# EAGLE design rfidbadge (EAGLE 6.6.0)
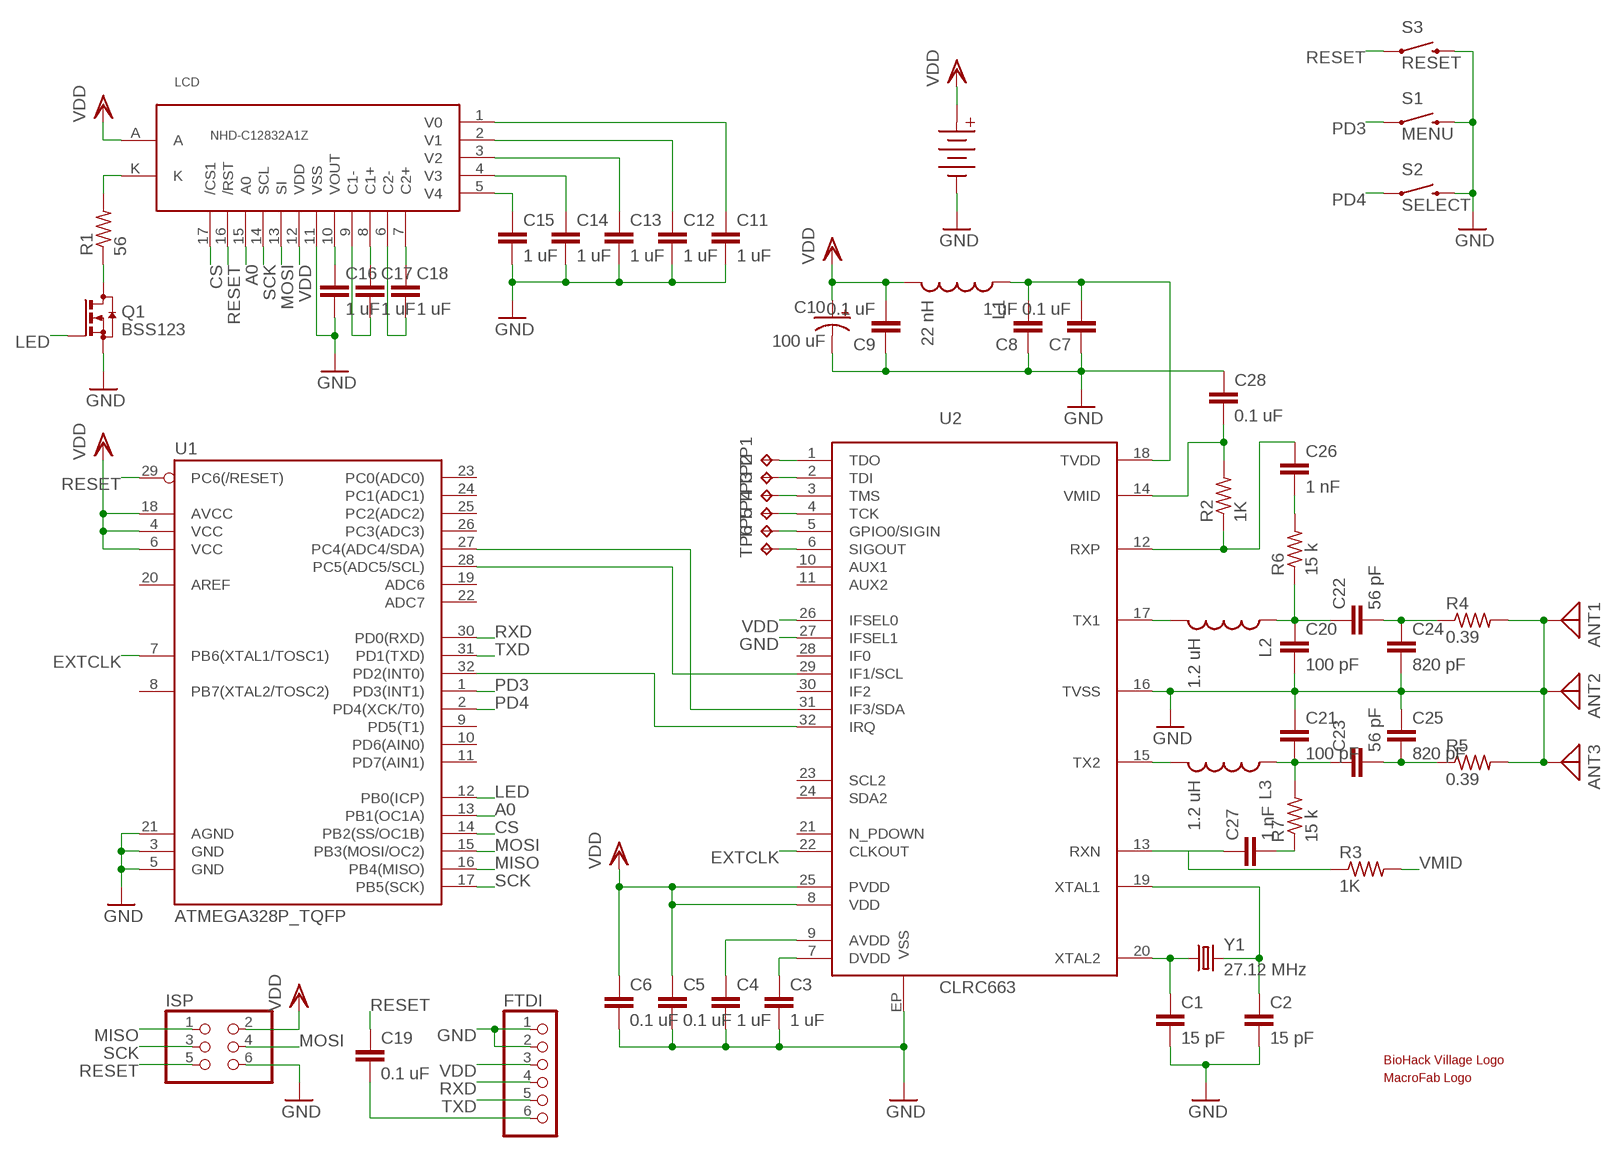
[diagram p0: schematic, sheet 1]

## Parts
ANT1  ANTENNA  [PAD-01]
ANT2  ANTENNA  [PAD-01]
ANT3  ANTENNA  [PAD-01]
BAT  AAA_X3  [AAA_X3]
C1  15 pF  C-EUC0603K  [C0603K]
C2  15 pF  C-EUC0603K  [C0603K]
C3  1 uF  C-EUC0603K  [C0603K]
C4  1 uF  C-EUC0603K  [C0603K]
C5  0.1 uF  C-EUC0603K  [C0603K]
C6  0.1 uF  C-EUC0603K  [C0603K]
C7  0.1 uF  C-EUC0603K  [C0603K]
C8  1 uF  C-EUC0603K  [C0603K]
C9  0.1 uF  C-EUC0603K  [C0603K]
C10  100 uF  CAP_POL7343  [EIA7343]
C11  1 uF  C-EUC0603K  [C0603K]
C12  1 uF  C-EUC0603K  [C0603K]
C13  1 uF  C-EUC0603K  [C0603K]
C14  1 uF  C-EUC0603K  [C0603K]
C15  1 uF  C-EUC0603K  [C0603K]
C16  1 uF  C-EUC0603K  [C0603K]
C17  1 uF  C-EUC0603K  [C0603K]
C18  1 uF  C-EUC0603K  [C0603K]
C19  0.1 uF  C-EUC0603K  [C0603K]
C20  100 pF  C-EUC0603K  [C0603K]
C21  100 pF  C-EUC0603K  [C0603K]
C22  56 pF  C-EUC0603K  [C0603K]
C23  56 pF  C-EUC0603K  [C0603K]
C24  820 pF  C-EUC0603K  [C0603K]
C25  820 pF  C-EUC0603K  [C0603K]
C26  1 nF  C-EUC0603K  [C0603K]
C27  1 nF  C-EUC0603K  [C0603K]
C28  0.1 uF  C-EUC0603K  [C0603K]
FTDI  PINHD-1X6  [1X06]
ISP  PINHD-2X3  [2X03]
L1  22 nH  INDUCTOR30OHM,1.8A  [0603]
L2  1.2 uH  INDUCTOR30OHM,1.8A  [0603]
L3  1.2 uH  INDUCTOR30OHM,1.8A  [0603]
LCD  NHD-C12832A1Z  [NHD-C12832A1Z]
Q1  BSS123  [SOT23]
R1  56  R-US_R0603  [R0603]
R2  1K  R-US_R0603  [R0603]
R3  1K  R-US_R0603  [R0603]
R4  0.39  R-US_R0603  [R0603]
R5  0.39  R-US_R0603  [R0603]
R6  15 k  R-US_R0603  [R0603]
R7  15 k  R-US_R0603  [R0603]
S1  MENU  SWITCH-MOMENTARY-2SMD-4  [TACTILE_SWITCH_TALL]
S2  SELECT  SWITCH-MOMENTARY-2SMD-4  [TACTILE_SWITCH_TALL]
S3  RESET  SWITCH-MOMENTARY-2SMD-1101NE  [TACTILE-SWITCH-1101NE]
TP1  TPTP06R  [TP06R]
TP2  TPTP06R  [TP06R]
TP3  TPTP06R  [TP06R]
TP4  TPTP06R  [TP06R]
TP5  TPTP06R  [TP06R]
TP6  TPTP06R  [TP06R]
U1  ATMEGA328P_TQFP  [TQFP32-08]
U2  CLRC663  [QFN32]
U$1  BHVLOGO  [BHVLOGO]
U$2  MACROFABLOGO  [MACROFABLOGO]
Y1  27.12 MHz  CRYSTALCRYSTAL-SMD-5X3-12.288MHZ  [CRYSTAL-SMD-5X3]

## Nets
A0: LCD.15(A0) U1.13(PB1(OC1A))
C1+: C17.1 LCD.8(C1+)
C1-: C17.2 LCD.9(C1-)
C2+: C18.1 LCD.7(C2+)
C2-: C18.2 LCD.6(C2-)
CS: LCD.17(/CS1) U1.14(PB2(SS/OC1B))
EXTCLK: U1.7(PB6(XTAL1/TOSC1)) U2.22(CLKOUT)
GND: ANT1.1 ANT2.1 ANT3.1 BAT.NEG C1.2 C2.2 C3.2 C4.2 C5.2 C6.2 C7.1 C8.1 C9.1 C10.C(-) C11.2 C12.2 C13.2 C14.2 C15.2 C16.2 C20.2 C21.1 C24.2 C25.1 C28.1 FTDI.1 FTDI.2 ISP.6 LCD.11(VSS) Q1.2(S) R4.2 R5.2 S1.B2 S2.B2 S3.2 U1.3(GND) U1.5(GND) U1.21(AGND) U2.16(TVSS) U2.27(IFSEL1) U2.EP(VSS)
K: LCD.K R1.2
LED: Q1.1(G) U1.12(PB0(ICP))
MISO: ISP.1 U1.16(PB4(MISO))
MOSI: ISP.4 LCD.13(SI) U1.15(PB3(MOSI/OC2))
N$1: C20.1 C22.1 L2.1 R6.1
N$2: C21.2 C23.1 L3.1 R7.2
N$3: C22.2 C24.1 R4.1
N$4: C23.2 C25.2 R5.1
N$5: TP1.TP U2.1(TDO)
N$6: TP2.TP U2.2(TDI)
N$7: C26.2 R6.2
N$8: C27.2 R7.1
N$9: C27.1 R3.1 U2.13(RXN)
N$10: C4.1 U2.9(AVDD)
N$11: C3.1 U2.7(DVDD)
N$12: TP3.TP U2.3(TMS)
N$13: TP4.TP U2.4(TCK)
N$14: TP5.TP U2.5(GPIO0/SIGIN)
N$15: TP6.TP U2.6(SIGOUT)
N$17: Q1.3(D) R1.1
N$19: C19.2 FTDI.6
PD2: U1.32(PD2(INT0)) U2.32(IRQ)
PD3: S1.A2 U1.1(PD3(INT1))
PD4: S2.A2 U1.2(PD4(XCK/T0))
RESET: C19.1 ISP.5 LCD.16(/RST) S3.1 U1.29(PC6(/RESET))
RXD: FTDI.4 U1.30(PD0(RXD))
RXP: C26.1 R2.1 U2.12(RXP)
SCK: ISP.3 LCD.14(SCL) U1.17(PB5(SCK))
SCL: U1.28(PC5(ADC5/SCL)) U2.29(IF1/SCL)
SDA: U1.27(PC4(ADC4/SDA)) U2.31(IF3/SDA)
TVDD: C7.2 C8.2 L1.1 U2.18(TVDD)
TX1: L2.2 U2.17(TX1)
TX2: L3.2 U2.15(TX2)
TXD: FTDI.5 U1.31(PD1(TXD))
V0: C11.1 LCD.1(V0)
V1: C12.1 LCD.2(V1)
V2: C13.1 LCD.3(V2)
V3: C14.1 LCD.4(V3)
V4: C15.1 LCD.5(V4)
VDD: BAT.POS C5.1 C6.1 C9.2 C10.A(+) FTDI.3 ISP.2 L1.2 LCD.12(VDD) LCD.A U1.4(VCC) U1.6(VCC) U1.18(AVCC) U2.8(VDD) U2.25(PVDD) U2.26(IFSEL0)
VMID: C28.2 R2.2 R3.2 U2.14(VMID)
VOUT: C16.1 LCD.10(VOUT)
XTAL1: C2.1 U2.19(XTAL1) Y1.3
XTAL2: C1.1 U2.20(XTAL2) Y1.1
Unconnected: U1.8(PB7(XTAL2/TOSC2)) U1.9(PD5(T1)) U1.10(PD6(AIN0)) U1.11(PD7(AIN1)) U1.19(ADC6) U1.20(AREF) U1.22(ADC7) U1.23(PC0(ADC0)) U1.24(PC1(ADC1)) U1.25(PC2(ADC2)) U1.26(PC3(ADC3)) U2.10(AUX1) U2.11(AUX2) U2.21(N_PDOWN) U2.23(SCL2) U2.24(SDA2) U2.28(IF0) U2.30(IF2)

## Library data of the parts
ANT1-ANT3 = discrete:ANTENNA: Antenna
BAT = battery_holder:AAA_X3; PROD_ID: 36-2479-ND
C1 C2 = rcl:C-EU: CAPACITOR, European symbol; PROD_ID: 311-1060-1-ND
C3 C4 C8 C11-C18 = rcl:C-EU: CAPACITOR, European symbol; PROD_ID: 311-1443-1-ND
C5-C7 C9 C19 C28 = rcl:C-EU: CAPACITOR, European symbol; PROD_ID: 311-1088-1-ND
C10 = SparkFun-Passives:CAP_POL: Capacitor Polarized These are standard SMD and PTH capacitors. Normally 10uF, 47uF, and 100uF in electrolytic and tantalum varieties. Always verify the external diameter of the through hole cap, it varies with capacity, voltage, and manufacturer. The EIA devices should be standard.; PROD_ID: 399-3772-1-ND
C20 C21 = rcl:C-EU: CAPACITOR, European symbol; PROD_ID: 311-1069-1-ND
C22 C23 = rcl:C-EU: CAPACITOR, European symbol; PROD_ID: 445-1278-1-ND
C24 C25 = rcl:C-EU: CAPACITOR, European symbol; PROD_ID: 445-1292-1-ND
C26 C27 = rcl:C-EU: CAPACITOR, European symbol; PROD_ID: 311-1342-1-ND
FTDI = pinhead:PINHD-1X6: PIN HEADER; PROD_ID: 952-2270-ND
ISP = pinhead:PINHD-2X3: PIN HEADER; PROD_ID: 952-2121-ND
L1 = SparkFun-Passives:INDUCTOR: Inductors Basic Inductor/Choke - 0603 and 1206. Footprints are not proven and vary greatly between part numbers. INDUCTOR POWER 3.3UH 4.0A SMD 0.197" L x 0.197" W x 0.177" H (5.00mm x 5.00mm x 4.50mm); PROD_ID: 1276-6310-1-ND
L2 L3 = SparkFun-Passives:INDUCTOR: Inductors Basic Inductor/Choke - 0603 and 1206. Footprints are not proven and vary greatly between part numbers. INDUCTOR POWER 3.3UH 4.0A SMD 0.197" L x 0.197" W x 0.177" H (5.00mm x 5.00mm x 4.50mm); PROD_ID: 535-12527-1-ND
LCD = display:NHD-C12832A1Z
Q1 = transistor-small-signal:BSS123: N-CHANNEL MOS FET; PROD_ID: 2N7002ET1GOSCT-ND
R1 = rcl:R-US_: RESISTOR, American symbol; PROD_ID: P56GCT-ND
R2 R3 = rcl:R-US_: RESISTOR, American symbol; PROD_ID: P1.0KGCT-ND
R4 R5 = rcl:R-US_: RESISTOR, American symbol; PROD_ID: P.39AHCT-ND
R6 R7 = rcl:R-US_: RESISTOR, American symbol; PROD_ID: P15KGCT-ND
S1 S2 = SparkFun-Electromechanical:SWITCH-MOMENTARY-2: Various NO switches- pushbuttons, reed, etc; PROD_ID: CKN9112CT-ND
S3 = SparkFun-Electromechanical:SWITCH-MOMENTARY-2: Various NO switches- pushbuttons, reed, etc; PROD_ID: CKN10388CT-ND
TP1-TP6 = testpad:TP: Test pad
U1 = SparkFun-DigitalIC:ATMEGA328P_TQFP; PROD_ID: ATMEGA328PB-AURCT-ND
U2 = CLRC663:CLRC663; PROD_ID: 568-11528-ND
U$1 = artwork:BHVLOGO
U$2 = artwork:MACROFABLOGO
Y1 = SparkFun-FreqCtrl:CRYSTAL: Various standard crystals. Proven footprints.; PROD_ID: 887-1309-1-ND; VALUE: 12.288MHz

## Board
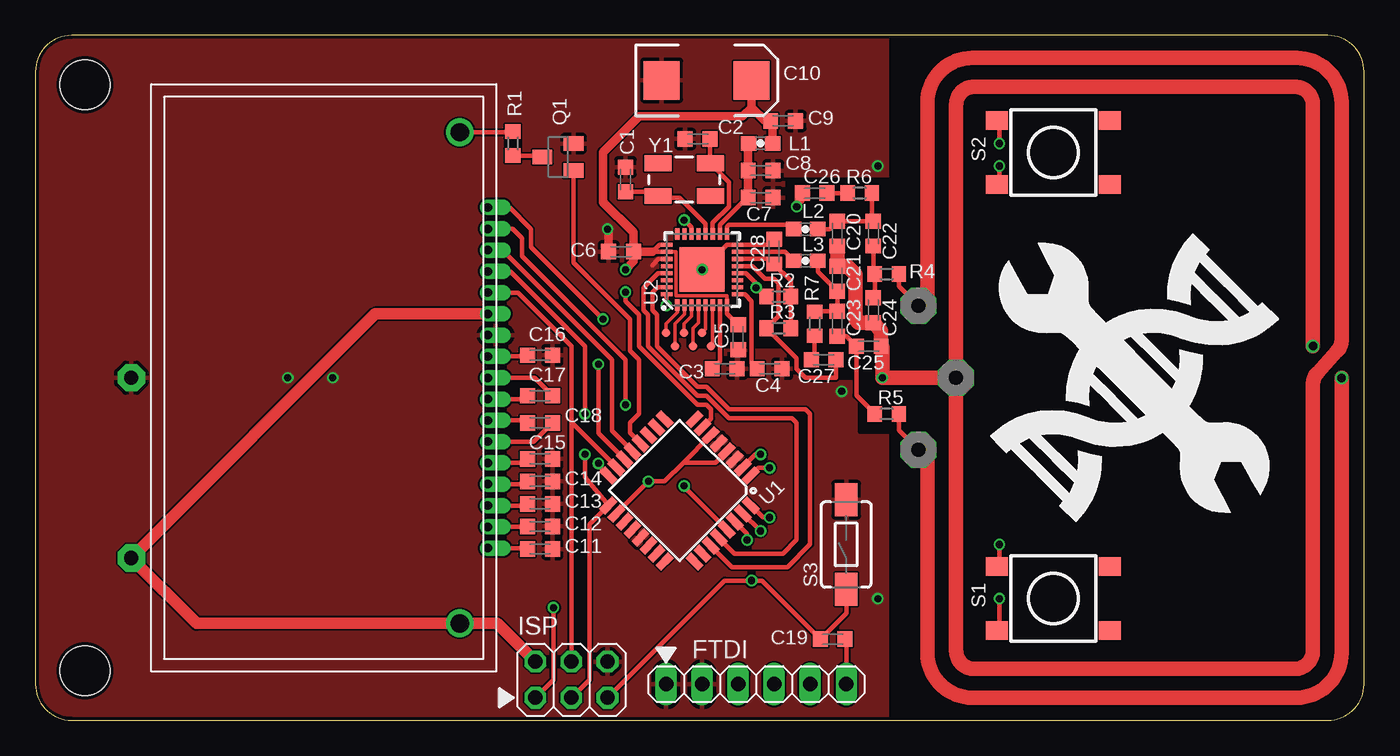
[diagram p1: board, top side]
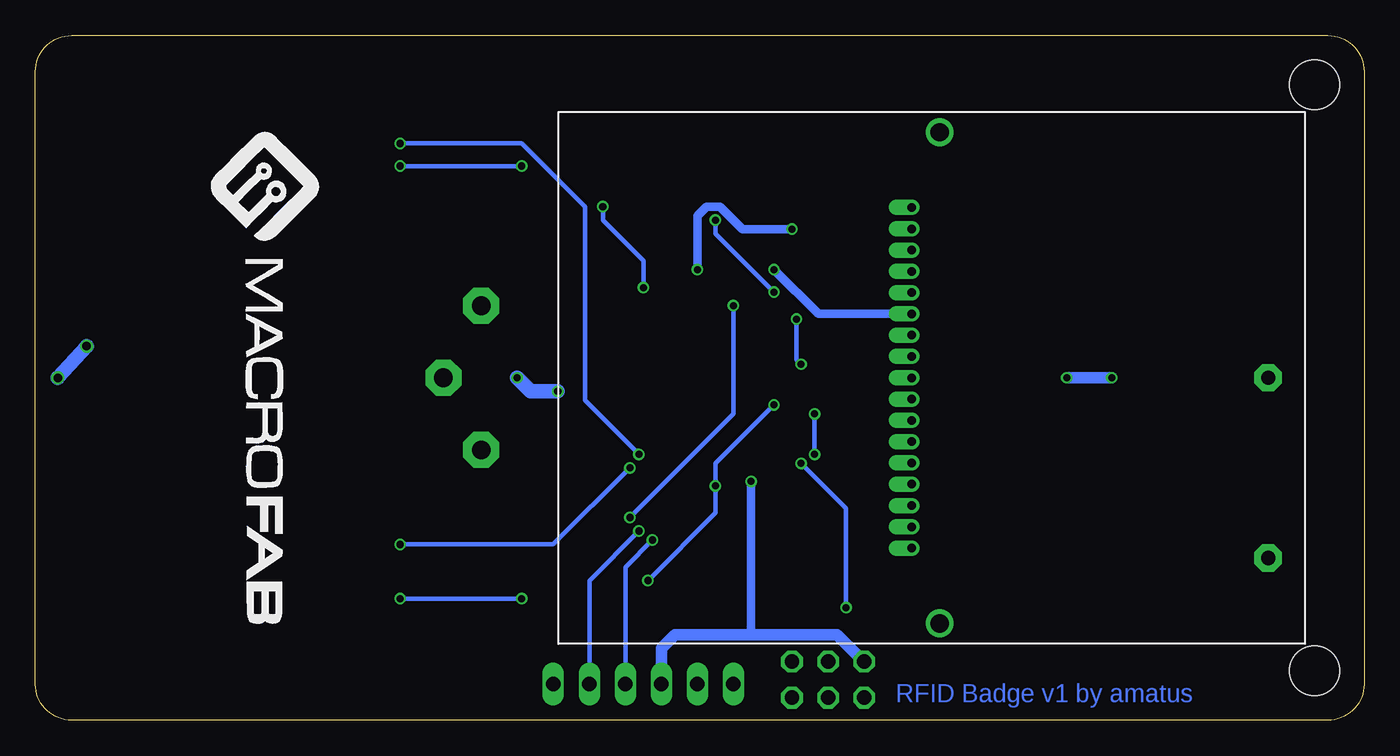
[diagram p2: board, bottom side, seen from below]

Size 93.65 x 48.25 mm. Coordinates in mm from the lower left corner, seen from the top.
Outline: 91.11,48.25 2.54,48.25 arc90 0,45.71 0,2.54 arc90 2.54,0 91.11,0 arc90 93.65,2.54 93.65,45.71 arc90 91.11,48.25
Copper layers (1*16): Top 0.035mm / dielectric 1.5mm / Bottom 0.035mm
Design rules "dirt_cheap_dirty_boards.v1 *": minimum track width 5mil, minimum drill 12mil, track to track 5mil, track to pad 5mil, pad to pad 5mil, via to via 5mil, smd to smd 0mil, copper to edge 10mil, drill to drill 10mil, minimum pad ring 10mil, minimum via ring 6mil, stop-mask expansion 2mil, vias tented up to drill 25mil, thermal gap 10mil
Holes 3.5 mm at 3.49,3.49 3.49,44.77
tRestrict: area 46,20.3 to 60.3,38.1; area 33,39.4 to 34.3,41.9

### Footprints (pad centres in the part's own frame; a part is rotated, then mirrored left to right if it is on the bottom)
PAD-01 = drill 1.321 pad 2.54 octagon: 1 0,0
AAA_X3 = drill 1 pad 1.93 octagon: NEG 23.724,0; POS 23.724,-12.7
C0603K = smd 1.05 x 1.08: 1 -0.875,0; 2 0.875,0
EIA7343 = smd 2.55 x 2.7: A 3.17,0; C -3.17,0
1X06 = drill 1.016 long: 1 -6.35,0; 2 -3.81,0; 3 -1.27,0; 4 1.27,0; 5 3.81,0; 6 6.35,0
2X03 = drill 1.016 octagon: 1 -2.54,-1.27; 2 -2.54,1.27; 3 0,-1.27; 4 0,1.27; 5 2.54,-1.27; 6 2.54,1.27
0603 = smd 1.1 x 1: 1 -0.85,0; 2 0.85,0
NHD-C12832A1Z = drill 0.6 offset: 1 -12,-11.55; 2 -10.5,-11.55; 3 -9,-11.55; 4 -7.5,-11.55; 5 -6,-11.55; 6 -4.5,-11.55; 7 -3,-11.55; 8 -1.5,-11.55; 9 0,-11.55; 10 1.5,-11.55; 11 3,-11.55; 12 4.5,-11.55; 13 6,-11.55; 14 7.5,-11.55; 15 9,-11.55; 16 10.5,-11.55; 17 12,-11.55 | drill 1.3: A -17.3,-9.6; K 17.3,-9.6
SOT23 = smd 1 x 1.4: 1 -0.95,-1.1; 2 0.95,-1.1; 3 0,1.1
R0603 = smd 1 x 1.1: 1 -0.85,0; 2 0.85,0
TACTILE_SWITCH_TALL = smd 1.55 x 1.3: A1 -3.975,-2.25; A2 3.975,-2.25; B1 -3.975,2.25; B2 3.975,2.25
TACTILE-SWITCH-1101NE = smd 2.3 x 1.6: 1 -3.15,0; 2 3.15,0
TP06R = smd 0.6 x 0.6: TP 0,0
TQFP32-08 = smd 1.27 x 0.559: 1 -4.293,2.8; 2 -4.293,2; 3 -4.293,1.2; 4 -4.293,0.4; 5 -4.293,-0.4; 6 -4.293,-1.2; 7 -4.293,-2; 8 -4.293,-2.8; 17 4.293,-2.8; 18 4.293,-2; 19 4.293,-1.2; 20 4.293,-0.4; 21 4.293,0.4; 22 4.293,1.2; 23 4.293,2; 24 4.293,2.8 | smd 0.559 x 1.27: 9 -2.8,-4.293; 10 -2,-4.293; 11 -1.2,-4.293; 12 -0.4,-4.293; 13 0.4,-4.293; 14 1.2,-4.293; 15 2,-4.293; 16 2.8,-4.293; 25 2.8,4.293; 26 2,4.293; 27 1.2,4.293; 28 0.4,4.293; 29 -0.4,4.293; 30 -1.2,4.293; 31 -2,4.293; 32 -2.8,4.293
QFN32 = smd 0.8 x 0.285: 1 -2.5,1.75; 2 -2.5,1.25; 3 -2.5,0.75; 4 -2.5,0.25; 5 -2.5,-0.25; 6 -2.5,-0.75; 7 -2.5,-1.25; 8 -2.5,-1.75; 17 2.5,-1.75; 18 2.5,-1.25; 19 2.5,-0.75; 20 2.5,-0.25; 21 2.5,0.25; 22 2.5,0.75; 23 2.5,1.25; 24 2.5,1.75 | smd 0.285 x 0.8: 9 -1.75,-2.5; 10 -1.25,-2.5; 11 -0.75,-2.5; 12 -0.25,-2.5; 13 0.25,-2.5; 14 0.75,-2.5; 15 1.25,-2.5; 16 1.75,-2.5; 25 1.75,2.5; 26 1.25,2.5; 27 0.75,2.5; 28 0.25,2.5; 29 -0.25,2.5; 30 -0.75,2.5; 31 -1.25,2.5; 32 -1.75,2.5 | smd 3.15 x 3.15: EP 0,0
CRYSTAL-SMD-5X3 = smd 1.9 x 1.1: 1 -1.85,-1.15; 2 1.85,-1.15; 3 1.85,1.15; 4 -1.85,1.15

### Placement (x,y rotation side)
ANT1  62.23,29.21 0 top
ANT2  64.9,24.13 0 top
ANT3  62.23,19.05 0 top
BAT  30.48,24.13 0 bottom
C1  41.59,38.1 90 top
C2  46.67,40.96 180 top
C3  48.58,24.77 0 top
C4  51.75,24.77 0 top
C5  49.53,26.99 270 top
C6  41.27,33.02 180 top
C7  51.12,36.83 180 top
C8  51.12,38.73 180 top
C9  52.7,42.23 180 top
C10  47.31,45.09 0 top
C11  35.56,12.06 0 top
C12  35.56,13.65 0 top
C13  35.56,15.24 0 top
C14  35.56,16.83 0 top
C15  35.56,18.41 0 top
C16  35.56,25.72 0 top
C17  35.56,22.86 0 top
C18  35.56,20.95 0 top
C19  56.2,5.71 0 top
C20  56.52,34.29 270 top
C21  56.52,31.11 270 top
C22  59.05,34.29 270 top
C23  56.52,27.94 270 top
C24  59.05,28.89 270 top
C25  58.74,26.35 180 top
C26  54.93,37.15 0 top
C27  55.56,25.4 180 top
C28  52.07,33.02 270 top
FTDI  50.8,2.54 0 top
ISP  37.78,2.86 0 top
L1  51.12,40.64 0 top
L2  54.29,34.61 180 top
L3  54.29,32.38 180 top
LCD  20.32,24.13 90 top
Q1  36.83,39.69 90 top
R1  33.66,40.64 90 top
R2  52.39,29.84 0 top
R3  52.39,27.62 0 top
R4  60.01,31.43 0 top
R5  60.01,21.59 0 top
R6  58.1,37.15 180 top
R7  54.93,27.94 90 top
S1  71.75,8.57 180 top
S2  71.75,40.01 180 top
S3  57.15,12.38 90 top
TP1  44.45,27.3 0 top
TP2  45.09,26.35 0 top
TP3  45.72,27.3 0 top
TP4  46.35,26.35 0 top
TP5  46.99,27.3 0 top
TP6  47.62,26.35 0 top
U1  45.4,16.19 225 top
U2  46.99,31.75 90 top
U$1  77.47,24.13 90 top
U$2  77.47,24.13 270 bottom
Y1  45.72,38.1 0 top

### Tracks (layer width: path | path; a pad name or v marks a point on that pad's centre or on a via)
A0
  Top 0.305: LCD.15 32.91,33.13 40.64,25.4 40.64,20.39 U1.13
C1+
  Top 0.305: LCD.8 34.45,22.63 C17.1
C1-
  Top 0.305: LCD.9 35.16,24.13 C17.2
C2+
  Top 0.305: LCD.7 34.51,21.13 C18.1
C2-
  Top 0.305: LCD.6 35.11,19.63 C18.2
CS  (via drill 0.5)
  Top 0.305: U1.14 39.69,20.21 v39.69,25.08 | v40.01,28.26 34.92,33.34 34.92,34.61 33.4,36.13 LCD.17
  Bottom 0.305: v39.69,25.08 40.01,25.4 v40.01,28.26
EXTCLK  (via drill 0.5)
  Top 0.305: U2.22 46.24,34.72 v45.72,35.24 | U1.7 47.62,21.24 47.62,21.91 47.31,22.23 46.67,22.23 42.55,26.35 42.55,28.57 41.59,29.53 v41.59,30.16
  Bottom 0.305: v45.72,35.24 45.72,34.29 v41.59,30.16
GND  (via drill 0.5, 0.6)
  Top 0.305: 56.43,33.5 C20.2 | U2.EP 48.74,33.5 U2.16 51.67,33.5 C28.1 | U2.27 43.93,32.5 43.5,32.07 | S1.B2 67.94,6.32 v67.94,8.57 | S2.B2 67.94,37.76 v67.94,39.05 | R4.2 60.86,30.58 ANT1.1 | R5.2 60.86,20.42 ANT3.1
  Top 0.61: v40.32,34.61 40.4,34.53 C6.2
  Top 1.016: C20.2 C21.1 57.23,31.99 57.78,31.43 57.78,28.26 58.02,28.02 C24.2 59.61,27.46 C25.1 59.69,26.27 v59.69,24.13 ANT2.1 | ANT2.1 64.9,43.37 arc-90 66.17,44.64 88.77,44.64 arc-90 90.04,43.37 v90.04,26.35 | ANT2.1 64.9,4.89 arc90 66.17,3.62 88.77,3.62 arc90 90.04,4.89 90.04,23.64 arc-42 90.38,24.49 91.74,25.99 arc42 92.08,26.85 92.08,43.5 arc90 88.9,46.67 66.04,46.67 arc90 62.87,43.5 62.87,29.21 ANT1.1 | v92.08,24.13 92.08,4.76 arc-90 88.9,1.59 66.04,1.59 arc-90 62.87,4.76 62.87,19.05 ANT3.1
  Bottom 0.305: v67.94,39.05 v59.37,39.05 | v67.94,8.57 v59.37,8.57
  Bottom 0.61: U2.EP 46.99,35.56 46.35,36.2 45.4,36.2 43.81,34.61 v40.32,34.61
  Bottom 0.813: v20.95,24.13 v17.78,24.13
  Bottom 1.016: v90.04,26.35 v92.08,24.13 | v59.69,24.13 58.74,23.18 v56.83,23.18
  other vias: 46.99,31.75
  pour Top: 0,48.26 0,0 60.01,0 60.01,48.26
K
  Top 0.305: LCD.K 33.59,41.43 R1.2
LED
  Top 0.305: U1.12 41.91,20.25 41.91,20.95 42.55,21.59 42.55,25.4 41.91,26.04 41.91,28.26 37.93,32.24 Q1.1
MISO  (via drill 0.5)
  Top 0.305: ISP.1 36.51,2.86 v36.51,7.94 | v39.69,18.1 39.69,17.95 U1.16
  Bottom 0.305: v36.51,7.94 36.51,14.92 v39.69,18.1
MOSI
  Top 0.305: LCD.13 34.01,30.13 37.78,26.35 37.78,20.98 | 37.78,20.98 U1.15 | ISP.4 37.78,20.98
N$1
  Top 0.305: R6.1 58.95,35.27 C22.1 C20.1 55.96,34.61 L2.1
N$2
  Top 0.305: L3.1 55.14,31.61 C21.2 C23.1 54.95,28.82 R7.2
N$3
  Top 0.305: C22.2 59.05,31.54 R4.1 59.16,29.87 C24.1
N$4
  Top 0.305: C23.2 57.15,27.07 C25.2 57.86,22.89 R5.1
N$5
  Top 0.254: TP1.TP 44.45,27.94 45.24,28.73 U2.1
N$6
  Top 0.254: TP2.TP 45.09,27.94 45.74,28.59 U2.2
N$7
  Top 0.305: R6.2 C26.2
N$8
  Top 0.305: R7.1 54.93,25.64 C27.2
N$9
  Top 0.305: C27.1 56.41,25.38 56.41,24.13 54.29,24.13 53.66,24.77 53.66,25.5 R3.1 52.39,28.47 52.39,30.8 52.07,31.11 51.44,31.11 50.55,32 U2.13
N$10
  Top 0.305: U2.9 50.01,30 50.48,29.53 50.48,25.16 C4.1
N$11
  Top 0.305: C3.1 48.24,25.3 U2.7
N$12
  Top 0.254: TP3.TP 45.72,27.94 46.24,28.46 U2.3
N$13
  Top 0.254: TP4.TP 46.35,27.62 46.74,28.01 U2.4
N$14
  Top 0.254: TP5.TP 47.24,27.55 U2.5
N$15
  Top 0.254: TP6.TP 47.74,26.47 U2.6
N$17
  Top 0.305: R1.1 35.63,39.79 Q1.3
N$19
  Top 0.305: C19.2 57.15,5.64 FTDI.6
PD2  (via drill 0.5)
  Top 0.305: v51.75,14.29 51.27,14.29 U1.32 | U2.32 44.49,29.25 v44.45,29.21
  Bottom 0.305: v51.75,14.29 44.45,21.59 v44.45,29.21
PD3  (via drill 0.5)
  Top 0.305: S1.A2 67.94,10.82 v67.94,12.38 | v51.75,17.78 50.95,17.78 U1.1
  Bottom 0.305: v67.94,12.38 57.15,12.38 v51.75,17.78
PD4  (via drill 0.5)
  Top 0.305: S2.A2 67.94,42.26 v67.94,40.64 | v51.12,18.73 50.77,18.73 U1.2
  Bottom 0.305: v67.94,40.64 59.37,40.64 54.93,36.2 54.93,22.54 v51.12,18.73
RESET  (via drill 0.5)
  Top 0.305: LCD.16 33.63,34.63 34.29,33.97 34.29,32.7 41.59,25.4 v41.59,22.23 | v45.72,16.51 45.72,16.44 U1.29 | ISP.5 48.58,9.84 v50.48,9.84 51.2,9.84 C19.1 57.15,7.54 S3.1
  Bottom 0.305: v41.59,22.23 45.72,18.1 v45.72,16.51 45.72,14.61 v50.48,9.84
RXD  (via drill 0.5)
  Top 0.305: U1.30 50.16,13.13 v50.16,12.7
  Bottom 0.305: v50.16,12.7 52.07,10.79 FTDI.4
RXP  (via drill 0.5)
  Top 0.305: U2.12 50.1,31.5 50.8,30.8 v50.8,30.48 51.44,29.84 R2.1 | C26.1 54.05,36.59 v53.66,36.2
  Bottom 0.305: v50.8,30.48 50.8,32.38 53.66,35.24 v53.66,36.2
SCK  (via drill 0.5)
  Top 0.305: LCD.14 33.46,31.63 38.73,26.35 v38.73,21.59 | v38.73,18.73 38.73,17.11 U1.17 39.05,13.8 39.05,2.86 ISP.3
  Bottom 0.305: v38.73,21.59 v38.73,18.73
SCL
  Top 0.305: U1.28 49.28,11.75 52.7,11.75 53.66,12.7 53.66,20.95 53.34,21.27 48.9,21.27 47.31,22.86 46.67,22.86 43.18,26.35 43.18,28.57 42.86,28.89 42.86,30.48 43.88,31.5 U2.29
SDA
  Top 0.305: U1.27 49.1,10.79 53.02,10.79 54.61,12.38 54.61,21.59 54.29,21.91 48.9,21.91 47.31,23.5 46.67,23.5 43.81,26.35 43.81,28.57 43.5,28.89 43.5,30.16 43.84,30.5 U2.31
TVDD
  Top 0.305: U2.18 48.24,34.91 50.16,36.83 C7.2 | 50.24,40.62 L1.1
  Top 0.61: 50.24,40.62 C8.2 C7.2
TX1
  Top 0.305: U2.17 48.74,34.77 48.9,34.92 53.12,34.92 L2.2
TX2
  Top 0.305: U2.15 52.83,33 L3.2
TXD  (via drill 0.5)
  Top 0.305: U1.31 51.09,13.34 v51.12,13.34
  Bottom 0.305: v51.12,13.34 54.61,9.84 FTDI.5
V0
  Top 0.305: LCD.1 34.62,12.13 C11.1
V1
  Top 0.305: LCD.2 34.66,13.63 C12.1
V2
  Top 0.305: LCD.3 34.58,15.13 C13.1
V3
  Top 0.305: LCD.4 34.49,16.63 C14.1
V4
  Top 0.305: LCD.5 34.4,18.13 C15.1
VDD  (via drill 0.5)
  Top 0.254: U2.26 45.16,33 45.16,29.92 48.74,29.92 U2.8
  Top 0.305: U2.26 43.5,33 44,33.5 U2.25 | 51.97,42.09 C9.2 51.42,42.23 | U1.18 v43.21,16.83 44.34,16.83 45.66,18.15 | 45.66,18.15 U1.6 | U1.4 47.93,18.15 45.66,18.15 | 48.74,29.67 U2.8 48.74,28.65 C5.1
  Top 0.61: 43.5,33 42.17,33 42.17,32.33 v41.59,31.75 | C10.A 50.48,43.17 | 50.48,43.17 49.85,42.55 42.55,42.55 40.01,40.01 40.01,36.51 42.15,34.37 C6.1 | 51.42,42.23 50.48,43.17 | 51.97,42.09 L1.2
  Top 0.813: LCD.12 23.96,28.63 BAT.POS 11.36,6.83 LCD.A 32.54,6.83 ISP.2 | 42.17,33 C6.1
  Bottom 0.61: LCD.12 38.47,28.63 v41.59,31.75 | v43.21,16.83 43.21,6.06 43.18,6.03
  Bottom 0.813: FTDI.3 49.53,5.08 48.58,6.03 43.18,6.03 37.15,6.03 ISP.2
VMID
  Top 0.305: U2.14 51.72,32.5 C28.2 53.24,30.98 R2.2 R3.2
VOUT
  Top 0.305: LCD.10 34.6,25.63 C16.1
XTAL1
  Top 0.305: U2.19 47.74,35.04 48.9,36.2 48.9,37.92 Y1.3 47.55,39.27 C2.1
XTAL2
  Top 0.305: U2.20 47.24,34.99 45.4,36.83 43.99,36.83 Y1.1 43.59,37.23 C1.1

### Text on the board
Bottom: RFID Badge v1 by amatus
tNames: S2 | S1
tValues: SELECT | MENU